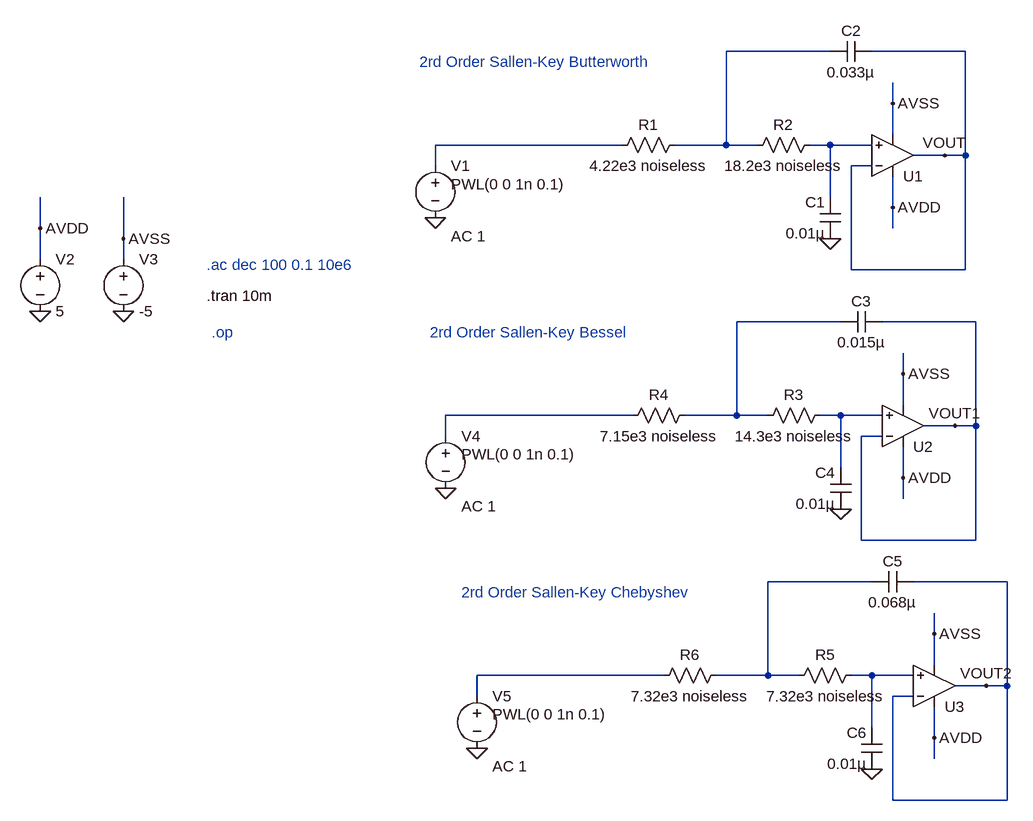
[diagram p0: schematic sallen_key_2nd_order.asc]
sallen_key_2nd_order.asc, the LTspice schematic file:
Version 4
SHEET 1 1276 1156
WIRE 464 0 304 0
WIRE 672 0 528 0
WIRE 560 80 560 48
WIRE 560 128 560 80
WIRE 144 144 -144 144
WIRE 304 144 304 0
WIRE 304 144 224 144
WIRE 352 144 304 144
WIRE 464 144 432 144
WIRE 528 144 464 144
WIRE 640 160 592 160
WIRE 672 160 672 0
WIRE 672 160 640 160
WIRE -144 176 -144 144
WIRE 528 176 496 176
WIRE 464 224 464 144
WIRE 560 240 560 192
WIRE -752 272 -752 224
WIRE 560 272 560 240
WIRE -624 288 -624 224
WIRE -752 320 -752 272
WIRE -624 320 -624 288
WIRE 496 336 496 176
WIRE 672 336 672 160
WIRE 672 336 496 336
WIRE 480 416 320 416
WIRE 688 416 544 416
WIRE 576 496 576 464
WIRE 576 544 576 496
WIRE 160 560 -128 560
WIRE 320 560 320 416
WIRE 320 560 240 560
WIRE 368 560 320 560
WIRE 480 560 448 560
WIRE 544 560 480 560
WIRE 656 576 608 576
WIRE 688 576 688 416
WIRE 688 576 656 576
WIRE -128 592 -128 560
WIRE 544 592 512 592
WIRE 480 640 480 560
WIRE 576 656 576 608
WIRE 576 688 576 656
WIRE 512 752 512 592
WIRE 688 752 688 576
WIRE 688 752 512 752
WIRE 528 816 368 816
WIRE 736 816 592 816
WIRE 624 896 624 864
WIRE 624 944 624 896
WIRE 208 960 -80 960
WIRE 368 960 368 816
WIRE 368 960 288 960
WIRE 416 960 368 960
WIRE 528 960 496 960
WIRE 592 960 528 960
WIRE 704 976 656 976
WIRE 736 976 736 816
WIRE 736 976 704 976
WIRE -80 992 -80 960
WIRE 592 992 560 992
WIRE 528 1040 528 960
WIRE 624 1056 624 1008
WIRE 624 1088 624 1056
WIRE 560 1152 560 992
WIRE 736 1152 736 976
WIRE 736 1152 560 1152
FLAG 464 288 0
FLAG -144 256 0
FLAG -752 400 0
FLAG -624 400 0
FLAG -752 272 AVDD
FLAG -624 288 AVSS
FLAG 640 160 VOUT
FLAG 560 80 AVSS
FLAG 560 240 AVDD
FLAG 480 704 0
FLAG -128 672 0
FLAG 656 576 VOUT1
FLAG 576 496 AVSS
FLAG 576 656 AVDD
FLAG 528 1104 0
FLAG -80 1072 0
FLAG 704 976 VOUT2
FLAG 624 896 AVSS
FLAG 624 1056 AVDD
DATAFLAG -48 144 ""
DATAFLAG 576 0 ""
DATAFLAG -32 560 ""
DATAFLAG 592 416 ""
DATAFLAG 16 960 ""
DATAFLAG 640 816 ""
SYMBOL Opamps\\UniversalOpamp2 560 160 M180
SYMATTR InstName U1
SYMBOL res 448 128 R90
WINDOW 0 0 56 VBottom 2
WINDOW 3 32 56 VTop 2
SYMATTR InstName R2
SYMATTR Value 18.2e3 noiseless
SYMBOL res 240 128 R90
WINDOW 0 0 56 VBottom 2
WINDOW 3 32 56 VTop 2
SYMATTR InstName R1
SYMATTR Value 4.22e3 noiseless
SYMBOL cap 528 -16 R90
WINDOW 0 0 32 VBottom 2
WINDOW 3 32 32 VTop 2
SYMATTR InstName C2
SYMATTR Value 0.033µ
SYMBOL cap 480 288 R180
WINDOW 0 24 56 Left 2
WINDOW 3 24 8 Left 2
SYMATTR InstName C1
SYMATTR Value 0.01µ
SYMBOL voltage -144 160 R0
WINDOW 123 24 124 Left 2
WINDOW 39 0 0 Left 0
WINDOW 3 24 44 Left 2
SYMATTR Value2 AC 1
SYMATTR Value PWL(0 0 1n 0.1)
SYMATTR InstName V1
SYMBOL voltage -752 304 R0
WINDOW 123 0 0 Left 0
WINDOW 39 0 0 Left 0
SYMATTR InstName V2
SYMATTR Value 5
SYMBOL voltage -624 304 R0
WINDOW 123 0 0 Left 0
WINDOW 39 0 0 Left 0
SYMATTR InstName V3
SYMATTR Value -5
SYMBOL Opamps\\UniversalOpamp2 576 576 M180
SYMATTR InstName U2
SYMBOL res 464 544 R90
WINDOW 0 0 56 VBottom 2
WINDOW 3 32 56 VTop 2
SYMATTR InstName R3
SYMATTR Value 14.3e3 noiseless
SYMBOL res 256 544 R90
WINDOW 0 0 56 VBottom 2
WINDOW 3 32 56 VTop 2
SYMATTR InstName R4
SYMATTR Value 7.15e3 noiseless
SYMBOL cap 544 400 R90
WINDOW 0 0 32 VBottom 2
WINDOW 3 32 32 VTop 2
SYMATTR InstName C3
SYMATTR Value 0.015µ
SYMBOL cap 496 704 R180
WINDOW 0 24 56 Left 2
WINDOW 3 24 8 Left 2
SYMATTR InstName C4
SYMATTR Value 0.01µ
SYMBOL voltage -128 576 R0
WINDOW 123 24 124 Left 2
WINDOW 39 0 0 Left 0
WINDOW 3 24 44 Left 2
SYMATTR Value2 AC 1
SYMATTR Value PWL(0 0 1n 0.1)
SYMATTR InstName V4
SYMBOL Opamps\\UniversalOpamp2 624 976 M180
SYMATTR InstName U3
SYMBOL res 512 944 R90
WINDOW 0 0 56 VBottom 2
WINDOW 3 32 56 VTop 2
SYMATTR InstName R5
SYMATTR Value 7.32e3 noiseless
SYMBOL res 304 944 R90
WINDOW 0 0 56 VBottom 2
WINDOW 3 32 56 VTop 2
SYMATTR InstName R6
SYMATTR Value 7.32e3 noiseless
SYMBOL cap 592 800 R90
WINDOW 0 0 32 VBottom 2
WINDOW 3 32 32 VTop 2
SYMATTR InstName C5
SYMATTR Value 0.068µ
SYMBOL cap 544 1104 R180
WINDOW 0 24 56 Left 2
WINDOW 3 24 8 Left 2
SYMATTR InstName C6
SYMATTR Value 0.01µ
SYMBOL voltage -80 976 R0
WINDOW 123 24 124 Left 2
WINDOW 39 0 0 Left 0
WINDOW 3 24 44 Left 2
SYMATTR Value2 AC 1
SYMATTR Value PWL(0 0 1n 0.1)
SYMATTR InstName V5
TEXT -168 16 Left 2 ;2rd Order Sallen-Key Butterworth
TEXT -496 328 Left 2 ;.ac dec 100 0.1 10e6
TEXT -496 376 Left 2 !.tran 10m
TEXT -488 432 Left 2 ;.op
TEXT -152 432 Left 2 ;2rd Order Sallen-Key Bessel
TEXT -104 832 Left 2 ;2rd Order Sallen-Key Chebyshev

The netlist it stands for:
* sallen_key_2nd_order.asc
XU1 N003 VOUT AVDD AVSS VOUT level.2 Avol=1Meg GBW=10Meg Slew=10Meg ilimit=25m rail=0 Vos=0 phimargin=45 en=0 enk=0 in=0 ink=0 Rin=500Meg  ; pins IN+ IN- V+ V- OUT
R2 N003 N001 18.2e3 noiseless
R1 N001 N002 4.22e3 noiseless
C2 VOUT N001 0.033µ
C1 0 N003 0.01µ
V1 N002 0 PWL(0 0 1n 0.1) AC 1
V2 AVDD 0 5
V3 AVSS 0 -5
XU2 N006 VOUT1 AVDD AVSS VOUT1 level.2 Avol=1Meg GBW=10Meg Slew=10Meg ilimit=25m rail=0 Vos=0 phimargin=45 en=0 enk=0 in=0 ink=0 Rin=500Meg  ; pins IN+ IN- V+ V- OUT
R3 N006 N004 14.3e3 noiseless
R4 N004 N005 7.15e3 noiseless
C3 VOUT1 N004 0.015µ
C4 0 N006 0.01µ
V4 N005 0 PWL(0 0 1n 0.1) AC 1
XU3 N009 VOUT2 AVDD AVSS VOUT2 level.2 Avol=1Meg GBW=10Meg Slew=10Meg ilimit=25m rail=0 Vos=0 phimargin=45 en=0 enk=0 in=0 ink=0 Rin=500Meg  ; pins IN+ IN- V+ V- OUT
R5 N009 N007 7.32e3 noiseless
R6 N007 N008 7.32e3 noiseless
C5 VOUT2 N007 0.068µ
C6 0 N009 0.01µ
V5 N008 0 PWL(0 0 1n 0.1) AC 1
* 2rd Order Sallen-Key Butterworth
* .ac dec 100 0.1 10e6
.tran 10m
* .op
* 2rd Order Sallen-Key Bessel
* 2rd Order Sallen-Key Chebyshev
.lib UniversalOpamps2.sub
.backanno
.end